# EAGLE design mass_slit7 (EAGLE 7.7.0)
Rev A1B
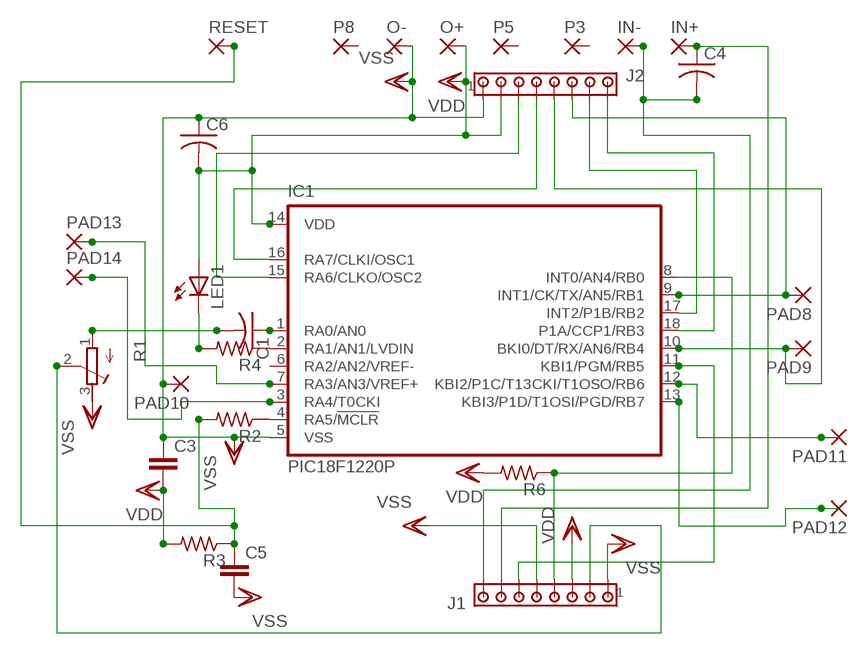
[diagram p0: schematic, sheet 1]

## Parts
C1  C-US025-040X050  [C025-040X050]
C3  C5/2.5  [C5B2.5]
C4  C-US025-040X050  [C025-040X050]
C5  C5/2.5  [C5B2.5]
C6  C-US025-040X050  [C025-040X050]
IC1  PIC18F1220P  [DIL18]
IN+  1,6/0,9  [1,6/0,9]
IN-  1,6/0,9  [1,6/0,9]
J1  MTA08-100  [10X08MTA]
J2  MTA08-100  [10X08MTA]
LED1  LED3MM  [LED3MM]
O+  1,6/0,9  [1,6/0,9]
O-  1,6/0,9  [1,6/0,9]
P3  1,6/0,9  [1,6/0,9]
P5  1,6/0,9  [1,6/0,9]
P8  1,6/0,9  [1,6/0,9]
PAD8  1,6/0,9  [1,6/0,9]
PAD9  1,6/0,9  [1,6/0,9]
PAD10  1,6/0,9  [1,6/0,9]
PAD11  1,6/0,9  [1,6/0,9]
PAD12  1,6/0,9  [1,6/0,9]
PAD13  1,6/0,9  [1,6/0,9]
PAD14  1,6/0,9  [1,6/0,9]
R1  R-TRIMM3339P  [RTRIM3339P]
R2  R-US_0204/2V  [0204V]
R3  R-US_0204/2V  [0204V]
R4  R-US_0204/2V  [0204V]
R6  R-US_0204/2V  [0204V]
RESET  1,6/0,9  [1,6/0,9]

## Nets
N$1: IC1.10(BKI0/DT/RX/AN6/RB4) J2.5 PAD9.1(P)
N$2: IC1.4(RA5/!MCLR) R2.1
N$3: C1.1 IC1.1(RA0/AN0)
N$4: C1.2 R1.1(A)
N$5: C4.1 IN+.1(P) J1.7
N$6: C4.2 IN-.1(P) J1.8
N$7: C5.1 R2.2 R3.1 RESET.1(P)
N$8: IC1.2(RA1/AN1/LVDIN) R4.1
N$9: IC1.8(INT0/AN4/RB0) J1.4 R6.1
N$10: IC1.13(KBI3/P1D/T1OSI/PGD/RB7) PAD12.1(P)
N$11: J1.2 R1.2(S)
N$12: IC1.9(INT1/CK/TX/AN5/RB1) J2.6 PAD8.1(P)
N$13: LED1.K(C) R4.2
N$14: IC1.11(KBI1/PGM/RB5) J1.6
N$15: IC1.17(INT2/P1B/RB2) J2.7
N$16: IC1.18(P1A/CCP1/RB3) J2.8
N$17: IC1.16(RA7/CLKI/OSC1) J2.4
N$18: IC1.15(RA6/CLKO/OSC2) J2.3
N$19: IC1.12(KBI2/P1C/T13CKI/T1OSO/RB6) PAD11.1(P)
N$20: IC1.7(RA3/AN3/VREF+) PAD13.1(P)
N$21: IC1.3(RA4/T0CKI) PAD14.1(P)
VDD: C3.2 C6.2 IC1.14(VDD) J1.3 J2.2 LED1.A O+.1(P) R3.2 R6.2
VSS: C3.1 C5.2 C6.1 IC1.5(VSS) J1.1 J1.5 J2.1 O-.1(P) PAD10.1(P) R1.3(E)
Unconnected: IC1.6(RA2/AN2/VREF-) P3.1(P) P5.1(P) P8.1(P)

## Library data of the parts
C1 C4 C6 = resistor:C-US: CAPACITOR, American symbol
C3 C5 = capacitor-wima:C: CAPACITOR naming: grid - package width
IC1 = microchip:PIC18F1*20: 18/20/28-Pin High-Performance, Enhanced Flash Microcontrollers with 10-bit A/D and nanoWatt Technology Source: ww1.microchip.com/downloads/en/DeviceDoc/39605c.pdf; MF: MICROCHIP; MPN: PIC18F1220-I/P; OC_FARNELL: 9761977; OC_NEWARK: 92C2429
IN+ IN- O+ O- P3 P5 P8 PAD8-PAD14 RESET = wirepad:1,6/0,9: THROUGH-HOLE PAD
J1 J2 = con-amp:MTA08-100: AMP connector
LED1 = led:LED: LED OSRAM: - CHIPLED LG R971, LG N971, LY N971, LG Q971, LY Q971, LO R971, LY R971 LH N974, LH R974 LS Q976, LO Q976, LY Q976 LO Q996 - Hyper CHIPLED LW Q18S LB Q993, LB Q99A, LB R99A - SideLED LS A670, LO A670, LY A670, LG A670, LP A670 LB A673, LV A673, LT A673, LW A673 LH A674 LY A675 LS A676, LA A676, LO A676, LY A676, LW A676 LS A679, LY A679, LG A679 - Hyper Micro SIDELED® LS Y876, LA Y876, LO Y876, LY Y876 LT Y87S - SmartLED LW L88C, LW L88S LB L89C, LB L89S, LG L890 LS L89K, LO L89K, LY L89K LS L896, LA L896, LO L896, LY L896 - TOPLED LS T670, LO T670, LY T670, LG T670, LP T670 LSG T670, LSP T670, LSY T670, LOP T670, LYG T670 LG T671, LOG T671, LSG T671 LB T673, LV T673, LT T673, LW T673 LH T674 LS T676, LA T676, LO T676, LY T676, LB T676, LH T676, LSB T676, LW T676 LB T67C, LV T67C, LT T67C, LS T67K, LO T67K, LY T67K, LW E67C LS E67B, LA E67B, LO E67B, LY E67B, LB E67C, LV E67C, LT E67C LW T67C LS T679, LY T679, LG T679 LS T770, LO T770, LY T770, LG T770, LP T770 LB T773, LV T773, LT T773, LW T773 LH T774 LS E675, LA E675, LY E675, LS T675 LS T776, LA T776, LO T776, LY T776, LB T776 LHGB T686 LT T68C, LB T68C - Hyper Mini TOPLED® LB M676 - Mini TOPLED Santana® LG M470 LS M47K, LO M47K, LY M47K Source: http://www.osram.convergy.de LUXEON: - LUMILED® LXK2-PW12-R00, LXK2-PW12-S00, LXK2-PW14-U00, LXK2-PW14-V00 LXK2-PM12-R00, LXK2-PM12-S00, LXK2-PM14-U00 LXK2-PE12-Q00, LXK2-PE12-R00, LXK2-PE12-S00, LXK2-PE14-T00, LXK2-PE14-U00 LXK2-PB12-K00, LXK2-PB12-L00, LXK2-PB12-M00, LXK2-PB14-N00, LXK2-PB14-P00, LXK2-PB14-Q00 LXK2-PR12-L00, LXK2-PR12-M00, LXK2-PR14-Q00, LXK2-PR14-R00 LXK2-PD12-Q00, LXK2-PD12-R00, LXK2-PD12-S00 LXK2-PH12-R00, LXK2-PH12-S00 LXK2-PL12-P00, LXK2-PL12-Q00, LXK2-PL12-R00 Source: www.luxeon.com KINGBRIGHT: KA-3528ASYC Source: www.kingbright.com
R1 = resistor:R-TRIMM: Trimm resistor
R2-R4 R6 = resistor:R-US_: RESISTOR, American symbol

## Net classes
0 default: clearance 0.205 mm

## Board
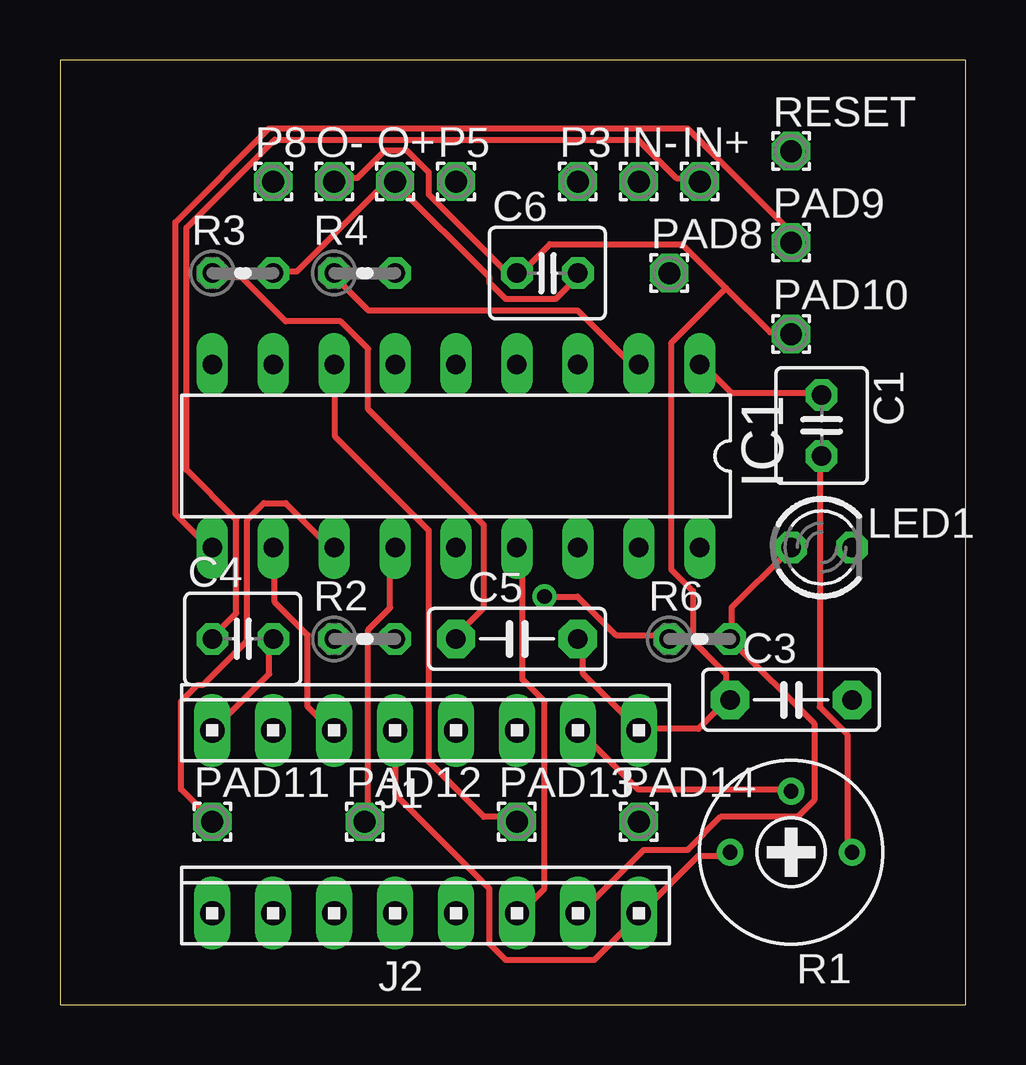
[diagram p1: board, top side]
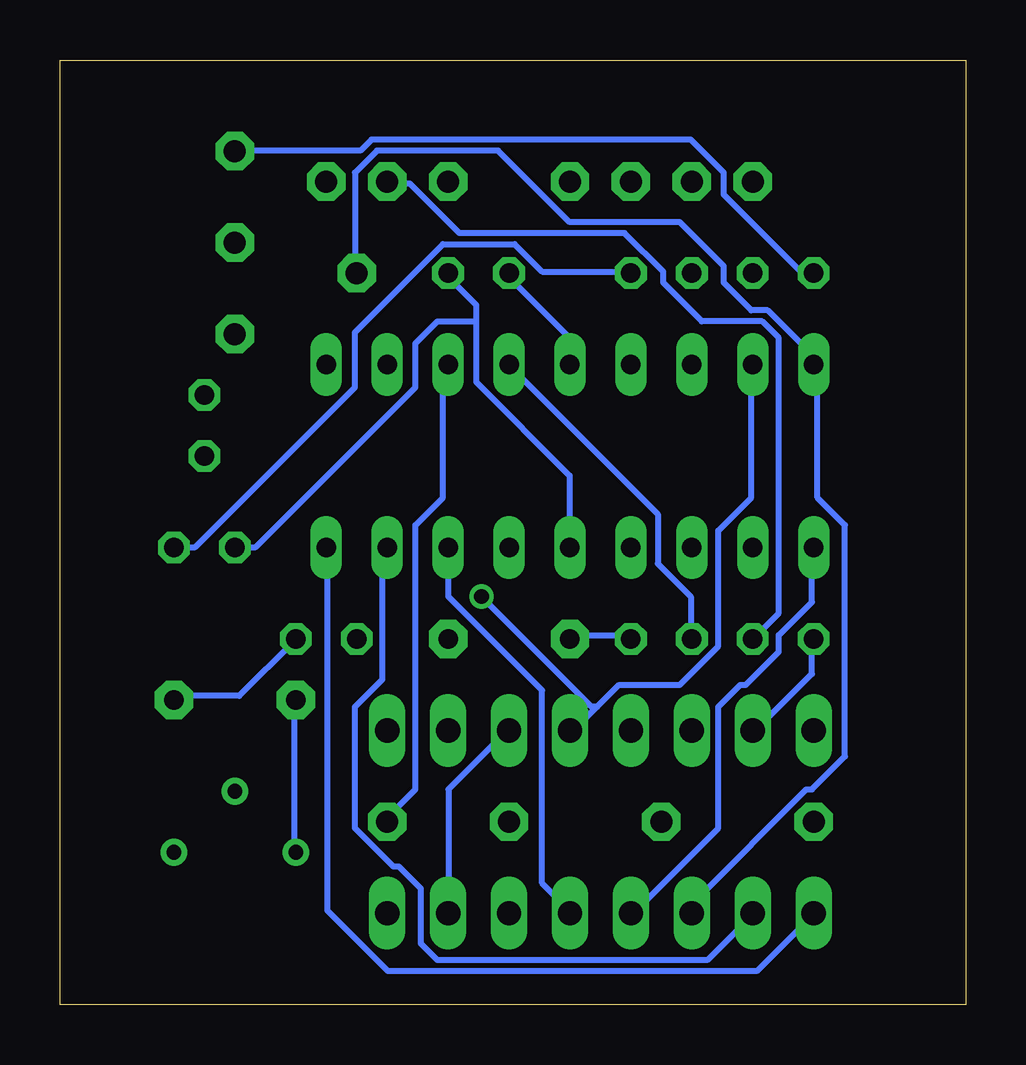
[diagram p2: board, bottom side, seen from below]

Size 37.77 x 39.36 mm. Coordinates in mm from the lower left corner, seen from the top.
Outline: 0,0 37.77,0 37.77,39.36 0,39.36 0,0
Copper layers (1*16): Top 0.035mm / dielectric 1.5mm / Bottom 0.035mm
Design rules "default": minimum track width 10mil, minimum drill 24mil, track to track 8mil, track to pad 8mil, pad to pad 8mil, via to via 8mil, smd to smd 8mil, copper to edge 40mil, drill to drill 8mil, minimum pad ring 10mil, minimum via ring 8mil, stop-mask expansion 4mil, vias tented up to drill 0mil, thermal gap 10mil

### Footprints (pad centres in the part's own frame; a part is rotated, then mirrored left to right if it is on the bottom)
C025-040X050 = drill 0.813 octagon: 1 -1.27,0; 2 1.27,0
C5B2.5 = drill 0.813 pad 1.6 octagon: 1 -2.54,0; 2 2.54,0
DIL18 = drill 0.813 long: 1 -10.16,-3.81; 2 -7.62,-3.81; 3 -5.08,-3.81; 4 -2.54,-3.81; 5 0,-3.81; 6 2.54,-3.81; 7 5.08,-3.81; 8 7.62,-3.81; 9 10.16,-3.81; 10 10.16,3.81; 11 7.62,3.81; 12 5.08,3.81; 13 2.54,3.81; 14 0,3.81; 15 -2.54,3.81; 16 -5.08,3.81; 17 -7.62,3.81; 18 -10.16,3.81
1,6/0,9 = drill 0.914 pad 1.6 octagon: 1 0,0
10X08MTA = drill 1.016 long: 1 8.89,0; 2 6.35,0; 3 3.81,0; 4 1.27,0; 5 -1.27,0; 6 -3.81,0; 7 -6.35,0; 8 -8.89,0
LED3MM = drill 0.813 octagon: A -1.27,0; K 1.27,0
RTRIM3339P = drill 0.61: 1 -2.54,0; 2 0,-2.54; 3 2.54,0
0204V = drill 0.813 octagon: 1 -1.27,0; 2 1.27,0

### Placement (x,y rotation side)
C1  31.75,24.13 270 top
C3  30.48,12.7 0 top
C4  7.62,15.24 0 top
C5  19.05,15.24 0 top
C6  20.32,30.48 0 top
IC1  16.51,22.86 180 top
IN+  26.67,34.29 0 top
IN-  24.13,34.29 0 top
J1  15.24,11.43 0 top
J2  15.24,3.81 0 top
LED1  31.75,19.05 0 top
O+  13.97,34.29 0 top
O-  11.43,34.29 0 top
P3  21.59,34.29 0 top
P5  16.51,34.29 0 top
P8  8.89,34.29 0 top
PAD8  25.4,30.48 0 top
PAD9  30.48,31.75 0 top
PAD10  30.48,27.94 0 top
PAD11  6.35,7.62 0 top
PAD12  12.7,7.62 0 top
PAD13  19.05,7.62 0 top
PAD14  24.13,7.62 0 top
R1  30.48,6.35 180 top
R2  12.7,15.24 0 top
R3  7.62,30.48 0 top
R4  12.7,30.48 0 top
R6  26.67,15.24 0 top
RESET  30.48,35.56 0 top

### Tracks (layer width: path | path; a pad name or v marks a point on that pad's centre or on a via)
N$1
  Top 0.254: PAD9.1 30.29,31.92 30.29,32.38 26.16,36.51 8.72,36.51 4.82,32.6 4.82,20.44 6.2,19.06 IC1.10
  Bottom 0.254: IC1.10 6.43,18.83 6.43,16.77 7.8,15.39 7.8,14.7 9.18,13.33 9.41,13.33 10.33,12.41 10.33,7.36 13.77,3.92 J2.5
N$2
  Bottom 0.254: R2.1 11.47,15.39 11.47,17 12.85,18.38 12.85,20.44 19.05,26.64 IC1.4
N$3
  Top 0.254: C1.1 31.67,25.49 28,25.49 26.85,26.64 IC1.1
N$4
  Top 0.254: R1.1 32.82,6.44 32.82,11.26 31.67,12.41 31.67,22.74 C1.2
N$5
  Top 0.254: IN+.1 26.62,34.44 25.7,34.44 24.1,36.05 8.95,36.05 5.28,32.38 5.28,22.28 7.34,20.21 7.34,16.31 6.43,15.39 C4.1
  Bottom 0.254: C4.1 6.43,15.16 6.43,13.79 8.72,11.49 J1.7
N$6
  Top 0.254: C4.2 8.72,15.16 8.72,13.79 6.43,11.49 J1.8
  Bottom 0.254: IN-.1 24.1,34.21 23.18,34.21 21.11,32.15 14.23,32.15 12.62,30.54 12.62,30.08 11.02,28.47 8.49,28.47 7.8,27.79 7.8,16.31 8.72,15.39 C4.2
N$7
  Top 0.254: R3.1 6.43,30.31 7.57,30.31 9.41,28.47 11.7,28.47 12.85,27.33 12.85,24.8 17.67,19.98 17.67,16.54 16.52,15.39 C5.1
  Bottom 0.254: R2.2 14,15.39 16.29,15.39 C5.1 | RESET.1 30.29,35.59 25.25,35.59 24.79,36.05 11.47,36.05 10.1,34.67 10.1,33.75 6.88,30.54 6.43,30.54 R3.1
N$8
  Top 0.254: IC1.2 24.1,26.87 23.64,26.87 21.57,28.93 12.85,28.93 11.47,30.31 R4.1
N$9  (via drill 0.61)
  Top 0.254: v20.2,17 21.57,17 23.18,15.39 25.25,15.39 R6.1
  Bottom 0.254: 15.38,12.41 16.29,11.49 J1.4 | 15.38,12.41 14.46,13.33 11.93,13.33 10.33,14.93 10.33,19.75 8.95,21.13 8.95,26.64 IC1.8 | v20.2,17 15.61,12.41 15.38,12.41
N$10
  Top 0.254: IC1.13 13.77,18.83 13.77,16.54 12.85,15.62 12.85,7.82 PAD12.1
N$11
  Top 0.254: R1.2 30.29,8.97 24.1,8.97 21.8,11.26 J1.2
N$12
  Bottom 0.254: J2.6 11.24,3.92 11.24,4.38 6.66,8.97 6.43,8.97 5.05,10.34 5.05,19.98 6.2,21.13 6.2,26.64 IC1.9 6.2,26.87 8.26,28.93 8.95,28.93 10.1,30.08 10.1,30.77 11.93,32.6 16.52,32.6 19.51,35.59 24.56,35.59 25.47,34.67 25.47,30.54 PAD8.1
N$13
  Bottom 0.254: R4.2 14,30.54 17.67,30.54 18.82,31.69 21.8,31.69 25.47,28.01 25.47,25.72 32.13,19.06 32.82,19.06 LED1.K
N$14
  Top 0.254: IC1.11 8.95,18.83 8.95,16.77 10.33,15.39 10.33,12.41 11.24,11.49 J1.6
N$15
  Bottom 0.254: IC1.17 24.33,18.83 24.33,13.56 25.47,12.41 25.47,7.36 23.87,5.75 23.64,5.75 22.72,4.83 22.72,2.54 22.03,1.85 10.79,1.85 8.95,3.69 J2.7
N$16
  Bottom 0.254: IC1.18 26.62,18.83 26.62,3.92 24.1,1.39 8.72,1.39 6.43,3.69 J2.8
N$17
  Bottom 0.254: IC1.16 21.57,18.83 21.57,17 17.67,13.1 17.67,5.06 16.52,3.92 J2.4
N$18
  Top 0.254: IC1.15 19.28,18.83 19.28,13.56 20.2,12.64 20.2,4.83 19.28,3.92 J2.3
N$19
  Top 0.254: IC1.12 11.24,19.06 9.41,20.9 8.49,20.9 7.8,20.21 7.8,15.16 5.97,13.33 5.74,13.33 5.05,12.64 5.05,8.97 6.2,7.82 PAD11.1
N$20
  Top 0.254: IC1.7 11.47,26.64 11.47,23.65 15.38,19.75 15.38,10.11 17.67,7.82 19.05,7.82 PAD13.1
N$21
  Bottom 0.254: IC1.3 21.8,26.64 21.8,21.13 22.95,19.98 22.95,8.97 24.1,7.82 PAD14.1
VDD
  Top 0.254: R3.2 8.95,30.54 9.87,30.54 13.77,34.44 O+.1 14,34.21 17.9,30.31 17.9,30.08 18.59,29.39 20.66,29.39 21.57,30.31 C6.2 | LED1.A 30.29,18.83 28,16.54 28,15.39 R6.2 28,15.16 31.44,11.72 31.44,8.51 30.75,7.82 27.54,7.82 26.16,6.44 24.33,6.44 21.8,3.92 J2.2
  Bottom 0.254: 20.43,28.47 20.43,29.16 21.57,30.31 C6.2 | 20.43,28.47 20.43,25.95 16.52,22.05 16.52,19.06 IC1.14 | J2.2 21.57,3.92 21.57,8.97 19.28,11.26 J1.3 | C3.2 32.82,12.87 30.29,12.87 28,15.16 R6.2 | 20.43,28.47 22.03,28.47 22.95,27.55 22.95,25.72 29.61,19.06 30.29,19.06 LED1.A
VSS
  Top 0.254: C5.2 21.8,15.16 21.8,13.79 24.1,11.49 J1.1 24.33,11.49 26.62,11.49 27.77,12.64 C3.1 27.77,12.87 27.77,13.79 26.39,15.16 26.39,17.23 25.47,18.15 25.47,27.55 27.77,29.85 | R1.3 27.77,6.21 26.62,6.21 24.33,3.92 J2.1 24.1,3.69 22.26,1.85 18.59,1.85 17.9,2.54 17.9,4.83 14,8.74 14,11.26 J1.5 | 27.77,29.85 25.93,31.69 20.43,31.69 19.28,30.54 C6.1 19.05,30.54 18.59,30.54 15.38,33.75 15.38,34.67 14.46,35.59 13.54,35.59 12.39,34.44 11.47,34.44 O-.1 | 27.77,29.85 29.61,28.01 30.29,28.01 PAD10.1
  Bottom 0.254: C3.1 28,12.64 28,6.44 R1.3 | IC1.5 16.52,26.87 16.52,27.79 19.05,30.31 C6.1